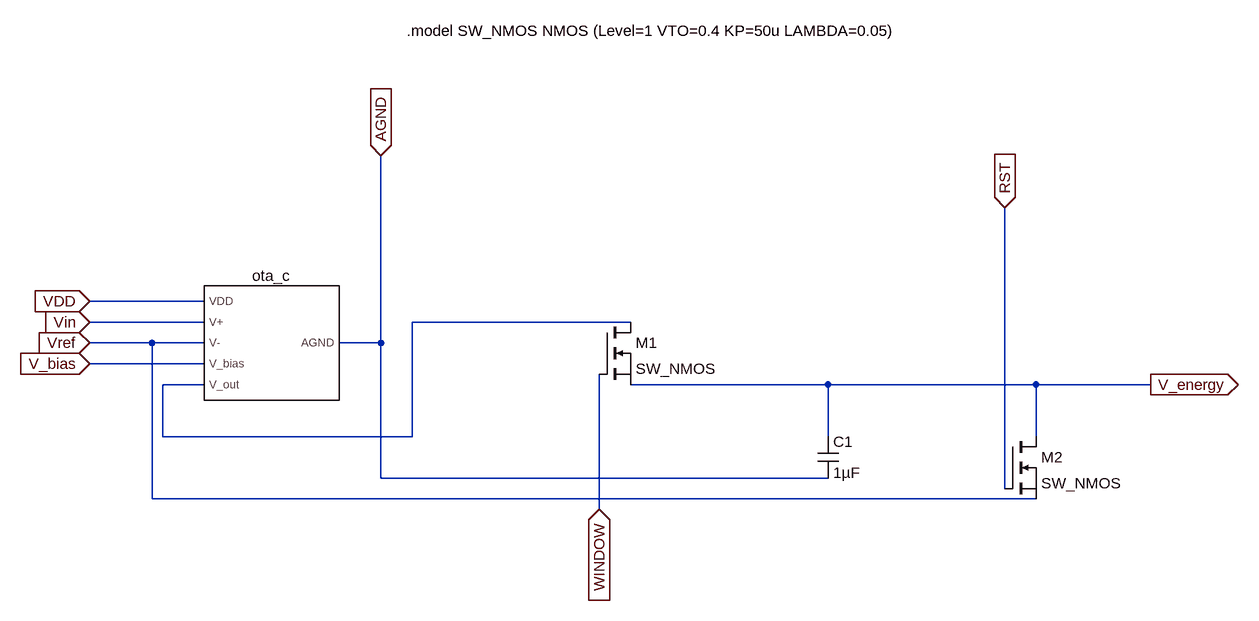
[diagram p0: schematic gated_integrator.asc]
gated_integrator.asc, the LTspice schematic file:
Version 4.1
SHEET 1 1656 680
WIRE 32 112 -144 112
WIRE 32 144 -144 144
WIRE 688 144 352 144
WIRE -48 176 -144 176
WIRE 32 176 -48 176
WIRE 304 176 304 -112
WIRE 304 176 240 176
WIRE 32 208 -144 208
WIRE 32 240 -32 240
WIRE 992 240 688 240
WIRE 1312 240 992 240
WIRE 1488 240 1312 240
WIRE -32 320 -32 240
WIRE 352 320 352 144
WIRE 352 320 -32 320
WIRE 992 320 992 240
WIRE 1312 320 1312 240
WIRE 304 384 304 176
WIRE 992 384 304 384
WIRE 1264 400 1264 -32
WIRE -48 416 -48 176
WIRE 1312 416 -48 416
WIRE 640 432 640 224
FLAG -144 144 Vin
IOPIN -144 144 In
FLAG -144 176 Vref
IOPIN -144 176 In
FLAG -144 112 VDD
IOPIN -144 112 In
FLAG -144 208 V_bias
IOPIN -144 208 In
FLAG 304 -112 AGND
IOPIN 304 -112 In
FLAG 1488 240 V_energy
IOPIN 1488 240 Out
FLAG 640 432 WINDOW
IOPIN 640 432 In
FLAG 1264 -32 RST
IOPIN 1264 -32 In
SYMBOL ota_core 128 176 R0
SYMATTR InstName ota_c
SYMBOL nmos 640 144 R0
SYMATTR InstName M1
SYMATTR Value SW_NMOS
SYMBOL nmos 1264 320 R0
SYMATTR InstName M2
SYMATTR Value SW_NMOS
SYMBOL cap 976 320 R0
SYMATTR InstName C1
SYMATTR Value 1µF
TEXT 344 -304 Left 2 !.model SW_NMOS NMOS (Level=1 VTO=0.4 KP=50u LAMBDA=0.05)

The netlist it stands for:
* gated_integrator.asc
X§ota_c VDD Vin Vref V_bias N001 AGND ota_core  ; pins VDD V+ V- V_bias V_out AGND
M1 N001 WINDOW V_energy V_energy SW_NMOS
M2 V_energy RST Vref Vref SW_NMOS
C1 V_energy AGND 1µF
.model NMOS NMOS
.model PMOS PMOS
.lib standard.mos
.model SW_NMOS NMOS (Level=1 VTO=0.4 KP=50u LAMBDA=0.05)
.backanno
.end